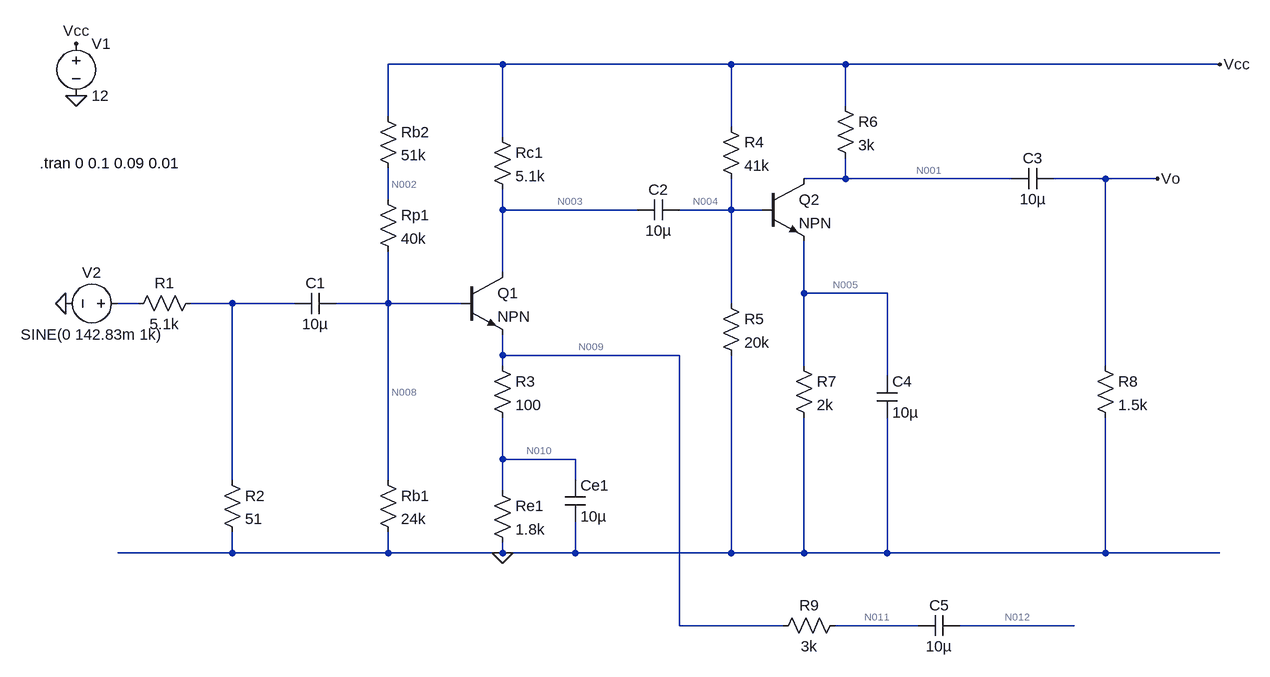
[diagram p0: schematic Experiment3_1_1.asc]
Experiment3_1_1.asc, the LTspice schematic file:
Version 4.1
SHEET 1 1464 880
WIRE 288 -32 112 -32
WIRE 640 -32 288 -32
WIRE 816 -32 640 -32
WIRE 1392 -32 816 -32
WIRE 816 32 816 -32
WIRE 112 48 112 -32
WIRE 640 64 640 -32
WIRE 288 80 288 -32
WIRE 816 144 816 112
WIRE 816 144 752 144
WIRE 1072 144 816 144
WIRE 1216 144 1136 144
WIRE 1296 144 1216 144
WIRE 112 176 112 128
WIRE 288 192 288 160
WIRE 496 192 288 192
WIRE 640 192 640 144
WIRE 640 192 560 192
WIRE 688 192 640 192
WIRE 288 288 288 192
WIRE 752 320 752 240
WIRE 880 320 752 320
WIRE -272 336 -304 336
WIRE -128 336 -192 336
WIRE -32 336 -128 336
WIRE 112 336 112 256
WIRE 112 336 32 336
WIRE 224 336 112 336
WIRE 640 336 640 192
WIRE 288 416 288 384
WIRE 560 416 288 416
WIRE 288 432 288 416
WIRE 752 432 752 320
WIRE 1216 432 1216 144
WIRE 880 448 880 320
WIRE 288 576 288 512
WIRE 400 576 288 576
WIRE -128 608 -128 336
WIRE 112 608 112 336
WIRE 400 608 400 576
WIRE 288 624 288 576
WIRE -128 720 -128 688
WIRE -128 720 -304 720
WIRE 112 720 112 688
WIRE 112 720 -128 720
WIRE 288 720 288 704
WIRE 288 720 112 720
WIRE 400 720 400 672
WIRE 400 720 288 720
WIRE 640 720 640 416
WIRE 640 720 400 720
WIRE 752 720 752 512
WIRE 752 720 640 720
WIRE 880 720 880 512
WIRE 880 720 752 720
WIRE 1216 720 1216 512
WIRE 1216 720 880 720
WIRE 1392 720 1216 720
WIRE 560 832 560 416
WIRE 720 832 560 832
WIRE 928 832 800 832
WIRE 1168 832 992 832
FLAG 288 720 0
FLAG 1392 -32 Vcc
FLAG -368 -64 Vcc
FLAG -368 16 0
FLAG -384 336 0
FLAG 1296 144 Vo
SYMBOL res -176 320 R90
WINDOW 0 0 56 VBottom 2
WINDOW 3 32 56 VTop 2
SYMATTR InstName R1
SYMATTR Value 5.1k
SYMBOL res -144 592 R0
SYMATTR InstName R2
SYMATTR Value 51
SYMBOL res 96 592 R0
SYMATTR InstName Rb1
SYMATTR Value 24k
SYMBOL res 96 160 R0
SYMATTR InstName Rp1
SYMATTR Value 40k
SYMBOL res 96 32 R0
SYMATTR InstName Rb2
SYMATTR Value 51k
SYMBOL npn 224 288 R0
SYMATTR InstName Q1
SYMBOL res 272 608 R0
SYMATTR InstName Re1
SYMATTR Value 1.8k
SYMBOL res 272 64 R0
SYMATTR InstName Rc1
SYMATTR Value 5.1k
SYMBOL voltage -368 -80 R0
WINDOW 123 0 0 Left 0
WINDOW 39 0 0 Left 0
SYMATTR InstName V1
SYMATTR Value 12
SYMBOL cap 32 320 R90
WINDOW 0 0 32 VBottom 2
WINDOW 3 32 32 VTop 2
SYMATTR InstName C1
SYMATTR Value 10µ
SYMATTR SpiceLine V=6.3 Irms=0 Rser=4 Lser=0 mfg="AVX" pn="TAJA106M006" type="Tantalum"
SYMBOL cap 496 208 R270
WINDOW 0 32 32 VTop 2
WINDOW 3 0 32 VBottom 2
SYMATTR InstName C2
SYMATTR Value 10µ
SYMATTR SpiceLine V=6.3 Irms=0 Rser=4 Lser=0 mfg="AVX" pn="TAJA106M006" type="Tantalum"
SYMBOL cap 384 608 R0
SYMATTR Value 10µ
SYMATTR InstName Ce1
SYMATTR SpiceLine V=6.3 Irms=0 Rser=4 Lser=0 mfg="AVX" pn="TAJA106M006" type="Tantalum"
SYMBOL voltage -288 336 R90
WINDOW 0 -32 56 VBottom 2
WINDOW 3 32 56 VTop 2
WINDOW 123 0 0 Left 0
WINDOW 39 0 0 Left 0
SYMATTR InstName V2
SYMATTR Value SINE(0 142.83m 1k)
SYMBOL res 272 416 R0
SYMATTR InstName R3
SYMATTR Value 100
SYMBOL res 624 48 R0
SYMATTR InstName R4
SYMATTR Value 41k
SYMBOL res 624 320 R0
SYMATTR InstName R5
SYMATTR Value 20k
SYMBOL npn 688 144 R0
SYMATTR InstName Q2
SYMBOL res 800 16 R0
SYMATTR InstName R6
SYMATTR Value 3k
SYMBOL cap 1072 160 R270
WINDOW 0 32 32 VTop 2
WINDOW 3 0 32 VBottom 2
SYMATTR InstName C3
SYMATTR Value 10µ
SYMATTR SpiceLine V=6.3 Irms=0 Rser=4 Lser=0 mfg="AVX" pn="TAJA106M006" type="Tantalum"
SYMBOL res 736 416 R0
SYMATTR InstName R7
SYMATTR Value 2k
SYMBOL cap 864 448 R0
SYMATTR InstName C4
SYMATTR Value 10µ
SYMATTR SpiceLine V=6.3 Irms=0 Rser=4 Lser=0 mfg="AVX" pn="TAJA106M006" type="Tantalum"
SYMBOL res 1200 416 R0
SYMATTR InstName R8
SYMATTR Value 1.5k
SYMBOL res 816 816 R90
WINDOW 0 0 56 VBottom 2
WINDOW 3 32 56 VTop 2
SYMATTR InstName R9
SYMATTR Value 3k
SYMBOL cap 928 848 R270
WINDOW 0 32 32 VTop 2
WINDOW 3 0 32 VBottom 2
SYMATTR InstName C5
SYMATTR Value 10µ
SYMATTR SpiceLine V=6.3 Irms=0 Rser=4 Lser=0 mfg="AVX" pn="TAJA106M006" type="Tantalum"
TEXT -424 120 Left 2 !.tran 0 0.1 0.09 0.01

The netlist it stands for:
* Experiment3_1_1.asc
R1 N007 N006 5.1k
R2 N007 0 51
Rb1 N008 0 24k
Rp1 N002 N008 40k
Rb2 Vcc N002 51k
Q1 N003 N008 N009 0 NPN
Re1 N010 0 1.8k
Rc1 Vcc N003 5.1k
V1 Vcc 0 12
C1 N008 N007 10µ V=6.3 Irms=0 Rser=4 Lser=0 mfg="AVX" pn="TAJA106M006" type="Tantalum"
C2 N003 N004 10µ V=6.3 Irms=0 Rser=4 Lser=0 mfg="AVX" pn="TAJA106M006" type="Tantalum"
Ce1 N010 0 10µ V=6.3 Irms=0 Rser=4 Lser=0 mfg="AVX" pn="TAJA106M006" type="Tantalum"
V2 N006 0 SINE(0 142.83m 1k)
R3 N009 N010 100
R4 Vcc N004 41k
R5 N004 0 20k
Q2 N001 N004 N005 0 NPN
R6 Vcc N001 3k
C3 N001 Vo 10µ V=6.3 Irms=0 Rser=4 Lser=0 mfg="AVX" pn="TAJA106M006" type="Tantalum"
R7 N005 0 2k
C4 N005 0 10µ V=6.3 Irms=0 Rser=4 Lser=0 mfg="AVX" pn="TAJA106M006" type="Tantalum"
R8 Vo 0 1.5k
R9 N011 N009 3k
C5 N011 N012 10µ V=6.3 Irms=0 Rser=4 Lser=0 mfg="AVX" pn="TAJA106M006" type="Tantalum"
.model NPN NPN
.model PNP PNP
.lib standard.bjt
.tran 0 0.1 0.09 0.01
.backanno
.end

* Results of the author's LTspice run, read from the files saved beside the schematic
* Operating Point, zero values left out:
*   V(n002) = 6.591 V
*   V(vcc) = 12 V
*   V(n009) = 1.579 V
*   V(n001) = 7.613 V
*   V(n011) = 1.579 V
*   V(n008) = 2.348 V
*   V(n003) = 7.804 V
*   V(n010) = 1.496 V
*   V(n004) = 3.738 V
*   V(n005) = 2.954 V
*   V(n012) = 1.579 V
*   Ic(Q1) = 822.8 µA
*   Ib(Q1) = 8.228 µA
*   Ie(Q1) = -831 µA
*   I(R3) = 831 µA
*   I(R5) = 186.9 µA
*   I(Rb1) = 97.84 µA
*   I(Rb2) = 106.1 µA
*   I(Rc1) = 822.8 µA
*   I(Rp1) = 106.1 µA
*   I(Re1) = 831 µA
*   I(V1) = -2.593 mA
*   I(R4) = 201.5 µA
*   Ic(Q2) = 1.462 mA
*   Ib(Q2) = 14.62 µA
*   Ie(Q2) = -1.477 mA
*   I(R6) = 1.462 mA
*   I(R7) = 1.477 mA
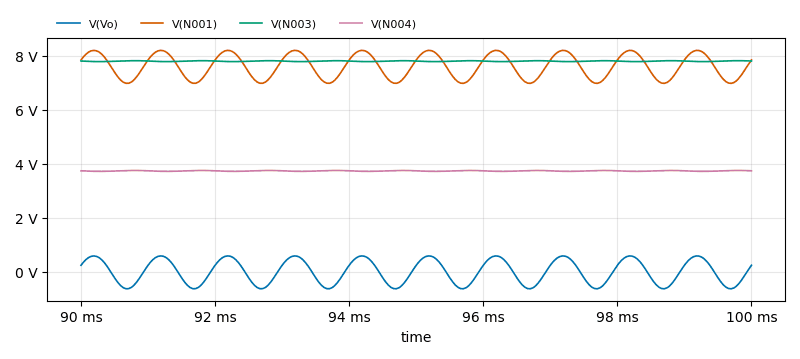
[diagram p1: Transient Analysis of Experiment3_1_1.asc, plotted from the saved traces]
* Transient Analysis, 1 run:
*   V(Vo): min -628.9 mV, max 590.3 mV, average -130.6 µV, rms 432.9 mV, last 243.4 mV
*   V(N001): min 6.981 V, max 8.203 V, average 7.611 V, rms 7.624 V, last 7.85 V
*   V(N003): min 7.787 V, max 7.821 V, average 7.804 V, rms 7.804 V, last 7.808 V
*   V(N004): min 3.721 V, max 3.755 V, average 3.738 V, rms 3.738 V, last 3.742 V